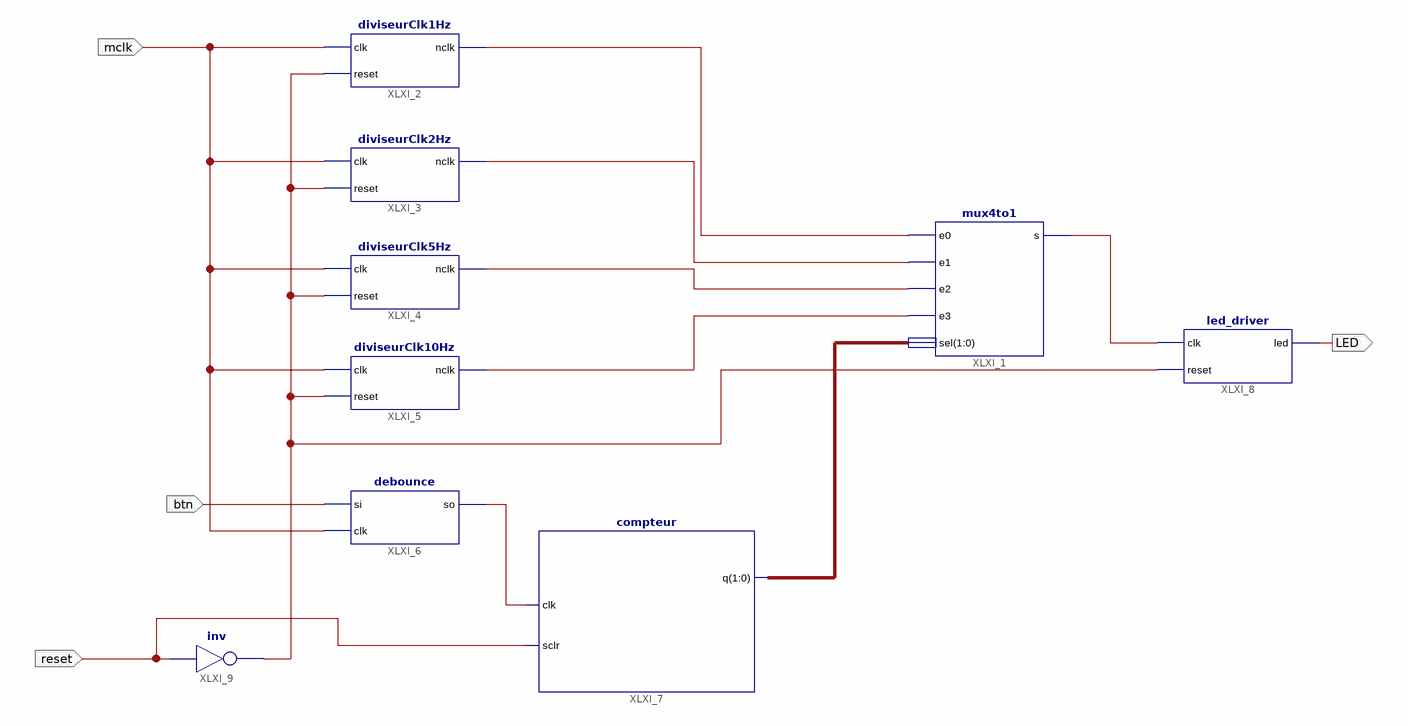
[diagram p0: schematic sheet 1]
// Xilinx ISE schematic clignoLed.sch (artix7) as structural Verilog: 9 symbols, 4 ports
module clignoLed (
  input  mclk,
  input  btn,
  input  reset,
  output LED
);

  wire XLXN_3, XLXN_4, XLXN_5, XLXN_6, XLXN_7, XLXN_11, XLXN_25;
  wire [1:0] XLXN_2;

  mux4to1 XLXI_1 (.e0(XLXN_7), .e1(XLXN_6), .e2(XLXN_5), .e3(XLXN_4), .sel(XLXN_2), .s(XLXN_25));
  diviseurClk1Hz XLXI_2 (.clk(mclk), .reset(XLXN_11), .nclk(XLXN_7));
  diviseurClk2Hz XLXI_3 (.clk(mclk), .reset(XLXN_11), .nclk(XLXN_6));
  diviseurClk5Hz XLXI_4 (.clk(mclk), .reset(XLXN_11), .nclk(XLXN_5));
  diviseurClk10Hz XLXI_5 (.clk(mclk), .reset(XLXN_11), .nclk(XLXN_4));
  debounce XLXI_6 (.si(btn), .clk(mclk), .so(XLXN_3));
  compteur XLXI_7 (.clk(XLXN_3), .sclr(reset), .q(XLXN_2));
  led_driver XLXI_8 (.clk(XLXN_25), .reset(XLXN_11), .led(LED));
  not XLXI_9 (XLXN_11, reset);
endmodule
